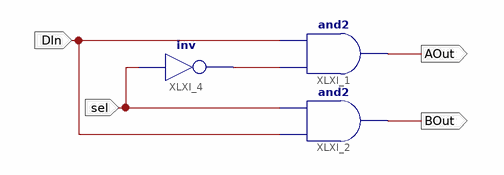
[diagram p0: schematic sheet 1]
// Xilinx ISE schematic Demux1to2.sch (spartan3e) as structural Verilog: 3 symbols, 4 ports
module Demux1to2 (
  input  DIn,
  input  sel,
  output AOut,
  output BOut
);

  wire XLXN_4;

  not XLXI_4 (XLXN_4, sel);
  and XLXI_1 (AOut, XLXN_4, DIn);
  and XLXI_2 (BOut, DIn, sel);
endmodule
